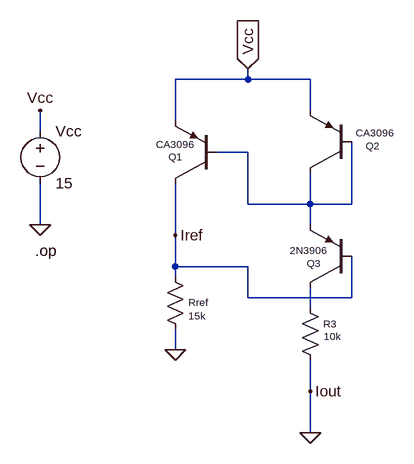
[diagram p0: schematic Lab5.3-part-C-transistor-array-Wilson.asc]
Lab5.3-part-C-transistor-array-Wilson.asc, the LTspice schematic file:
Version 4
SHEET 1 880 680
WIRE 208 16 208 0
WIRE 208 16 96 16
WIRE 304 16 208 16
WIRE 304 64 304 16
WIRE 96 80 96 16
WIRE -112 96 -112 64
WIRE 208 128 160 128
WIRE 208 208 208 128
WIRE 304 208 304 160
WIRE 304 208 208 208
WIRE 368 208 368 112
WIRE 368 208 304 208
WIRE -112 240 -112 176
WIRE 304 240 304 208
WIRE 96 256 96 176
WIRE 96 304 96 256
WIRE 208 304 96 304
WIRE 96 320 96 304
WIRE 208 352 208 304
WIRE 368 352 368 288
WIRE 368 352 208 352
WIRE 304 368 304 336
WIRE 96 432 96 400
WIRE 304 496 304 448
WIRE 304 560 304 496
FLAG -112 240 0
FLAG -112 64 Vcc
FLAG 208 0 Vcc
IOPIN 208 0 In
FLAG 304 560 0
FLAG 96 432 0
FLAG 96 256 Iref
FLAG 304 496 Iout
SYMBOL pnp 160 176 R180
WINDOW 0 53 41 Left 1
WINDOW 3 36 60 Left 1
SYMATTR InstName Q1
SYMATTR Value CA3096
SYMBOL voltage -112 80 R0
SYMATTR InstName Vcc
SYMATTR Value 15
SYMBOL pnp 368 160 R180
WINDOW 0 -43 42 Left 1
WINDOW 3 -64 62 Left 1
SYMATTR InstName Q2
SYMATTR Value CA3096
SYMBOL res 80 304 R0
WINDOW 0 36 55 Left 1
WINDOW 3 36 76 Left 1
SYMATTR InstName Rref
SYMATTR Value 15k
SYMBOL pnp 368 336 R180
WINDOW 0 48 37 Left 1
WINDOW 3 39 57 Left 1
SYMATTR InstName Q3
SYMATTR Value 2N3906
SYMBOL res 288 352 R0
WINDOW 0 36 40 Left 1
WINDOW 3 37 59 Left 1
SYMATTR InstName R3
SYMATTR Value 10k
TEXT -120 280 Left 2 !.op

The netlist it stands for:
* Lab5.3-part-C-transistor-array-Wilson.asc
Q1 Iref N001 Vcc 0 CA3096
Vcc Vcc 0 15
Q2 N001 N001 Vcc 0 CA3096
Rref Iref 0 15k
Q3 N002 Iref N001 0 2N3906
R3 N002 0 10k
.model NPN NPN
.model PNP PNP
.lib standard.bjt
.op
.backanno
.end